# Altium project PCB_Project.PrjPcb
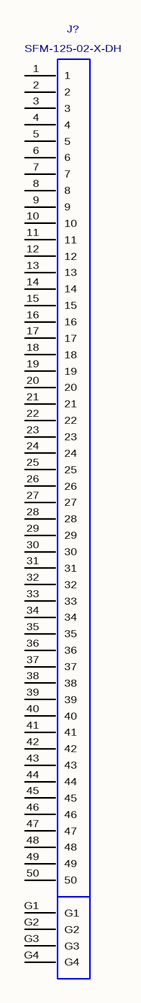
[diagram p0: DAQ Connector.SchDoc]
4 sheets, 80 parts. Net scope: flat (ports and power ports of the same name join across sheets).
Board file: FC_MainBoard.PcbDoc
Sheets:
  DAQ Connector.SchDoc
  Charge Amp.SchDoc
  Analog to Digital Con.SchDoc
  Low Pass Filter.SchDoc

## Sheet DAQ Connector.SchDoc
size A

### Parts
J?  SFM-125-02-X-DH  [SFM-125-02-X-DH]

### Nets

Not connected (* = marked no-connect by the designer): J? 1 2 3 4 5 6 7 8 9 10 11 12 13 14 15 16 17 18 19 20 21 22 23 24 25 26 27 28 29 30 31 32 33 34 35 36 37 38 39 40 41 42 43 44 45 46 47 48 49 50 G1 G2 G3 G4

### Library data of the parts
J? = SFM-125-02-X-DH: .050" (1,27mm) Tiger Eye Contact, Molded-to-Position Socket Strip, Double Horizontal.; MANUFACTURER: SAMTEC; CREATED: October 28, 2015 - Wendy Xin; PCB DECAL: SFM-125-02-X-DH

## Sheet Charge Amp.SchDoc
size A
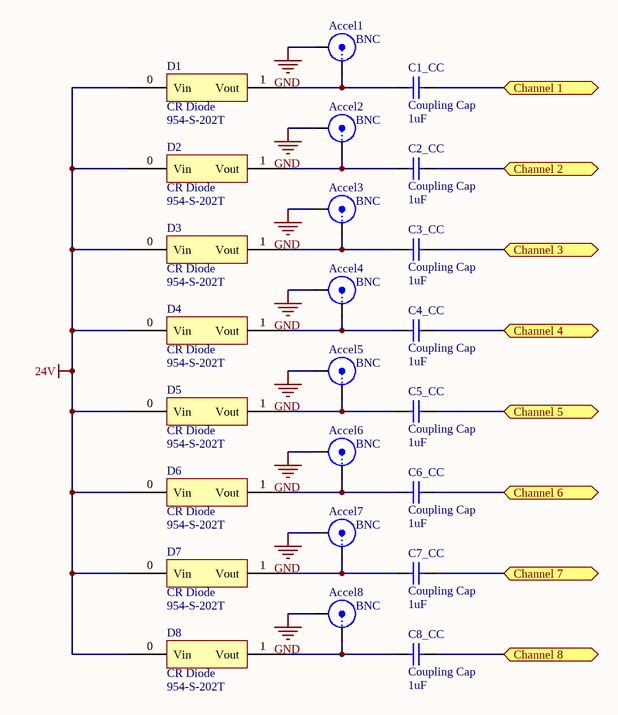
[diagram p1: Charge Amp.SchDoc]

### Parts
Accel1  BNC  [BNC_RA CON]
Accel2  BNC  [BNC_RA CON]
Accel3  BNC  [BNC_RA CON]
Accel4  BNC  [BNC_RA CON]
Accel5  BNC  [BNC_RA CON]
Accel6  BNC  [BNC_RA CON]
Accel7  BNC  [BNC_RA CON]
Accel8  BNC  [BNC_RA CON]
C1_CC  Coupling Cap  value 1uF  [C1206]
C2_CC  Coupling Cap  value 1uF  [C1206]
C3_CC  Coupling Cap  value 1uF  [C1206]
C4_CC  Coupling Cap  value 1uF  [C1206]
C5_CC  Coupling Cap  value 1uF  [C1206]
C6_CC  Coupling Cap  value 1uF  [C1206]
C7_CC  Coupling Cap  value 1uF  [C1206]
C8_CC  Coupling Cap  value 1uF  [C1206]
D1  CR Diode  Supplier Part Number 1: 954-S-202T  [CR Diode - duplicate1]
D2  CR Diode  Supplier Part Number 1: 954-S-202T  [CR Diode - duplicate1]
D3  CR Diode  Supplier Part Number 1: 954-S-202T  [CR Diode - duplicate1]
D4  CR Diode  Supplier Part Number 1: 954-S-202T  [CR Diode - duplicate1]
D5  CR Diode  Supplier Part Number 1: 954-S-202T  [CR Diode - duplicate1]
D6  CR Diode  Supplier Part Number 1: 954-S-202T  [CR Diode - duplicate1]
D7  CR Diode  Supplier Part Number 1: 954-S-202T  [CR Diode - duplicate1]
D8  CR Diode  Supplier Part Number 1: 954-S-202T  [CR Diode - duplicate1]

### Ports
Channel 1, Channel 2, Channel 3, Channel 4, Channel 5, Channel 6, Channel 7, Channel 8

### Nets
24V: D1.0(Vin) D2.0(Vin) D3.0(Vin) D4.0(Vin) D5.0(Vin) D6.0(Vin) D7.0(Vin) D8.0(Vin)
GND: Accel1.2(Y) Accel2.2(Y) Accel3.2(Y) Accel4.2(Y) Accel5.2(Y) Accel6.2(Y) Accel7.2(Y) Accel8.2(Y)
NetAccel1_1: Accel1.1(X) C1_CC.1 D1.1(Vout)
NetAccel2_1: Accel2.1(X) C2_CC.1 D2.1(Vout)
NetAccel3_1: Accel3.1(X) C3_CC.1 D3.1(Vout)
NetAccel4_1: Accel4.1(X) C4_CC.1 D4.1(Vout)
NetAccel5_1: Accel5.1(X) C5_CC.1 D5.1(Vout)
NetAccel6_1: Accel6.1(X) C6_CC.1 D6.1(Vout)
NetAccel7_1: Accel7.1(X) C7_CC.1 D7.1(Vout)
NetAccel8_1: Accel8.1(X) C8_CC.1 D8.1(Vout)
NetC1_CC_2: C1_CC.2 ; port Channel 1
NetC2_CC_2: C2_CC.2 ; port Channel 2
NetC3_CC_2: C3_CC.2 ; port Channel 3
NetC4_CC_2: C4_CC.2 ; port Channel 4
NetC5_CC_2: C5_CC.2 ; port Channel 5
NetC6_CC_2: C6_CC.2 ; port Channel 6
NetC7_CC_2: C7_CC.2 ; port Channel 7
NetC8_CC_2: C8_CC.2 ; port Channel 8

### Library data of the parts
Accel1-Accel8 = BNC: BNC Elbow Connector; LatestRevisionDate: 17-Jul-2002; LatestRevisionNote: Re-released for DXP Platform.; Publisher: Altium Limited
C1_CC C2_CC C3_CC C4_CC C5_CC C6_CC C7_CC C8_CC = Cap Semi: Capacitor (Semiconductor SIM Model); Published: 8-Jun-2000; LatestRevisionDate: 29-May-2009; LatestRevisionNote: IPC-7351 Footprint Added.; PackageReference: C1206; Publisher: Altium Limited; PackageDescription: Chip Capacitor
D1-D8 = Diode_1: Current Regulator Diodes 100V 2mA; Supplier 1: Mouser

## Sheet Analog to Digital Con.SchDoc
size A
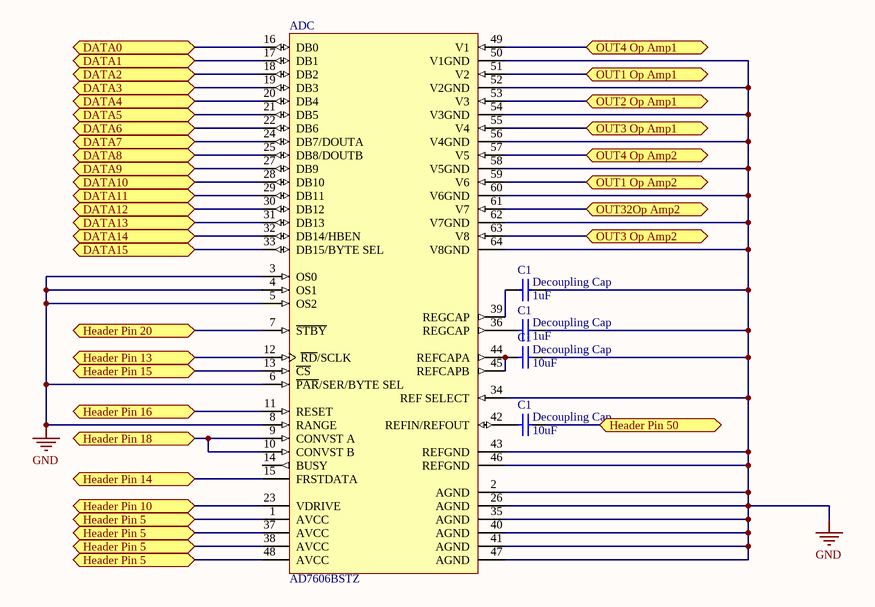
[diagram p2: Analog to Digital Con.SchDoc]

### Parts
(Parts that share a designator on the sheet are numbered #1, #2 ... from top to bottom, then left to right.)
ADC  AD7606BSTZ  [ST-64-2_N]
C1#1  Decoupling Cap  value 1uF  [C1206]
C1#2  Decoupling Cap  value 1uF  [C1206]
C1#3  Decoupling Cap  value 10uF  [C1206]
C1#4  Decoupling Cap  value 10uF  [C1206]

### Ports
DATA0, DATA1, DATA2, DATA3, DATA4, DATA5, DATA6, DATA7, DATA8, DATA9, DATA10, DATA11, DATA12, DATA13, DATA14, DATA15, Header Pin 5, Header Pin 10, Header Pin 13, Header Pin 14, Header Pin 15, Header Pin 16, Header Pin 18, Header Pin 20, Header Pin 50, OUT1 Op Amp1, OUT1 Op Amp2, OUT2 Op Amp1, OUT3 Op Amp1, OUT3 Op Amp2, OUT4 Op Amp1, OUT4 Op Amp2, OUT32Op Amp2

### Nets
GND: ADC.2(AGND) ADC.3(OS0) ADC.4(OS1) ADC.5(OS2) ADC.6(~{PAR}/SER/BYTE_SEL) ADC.8(RANGE) ADC.26(AGND) ADC.34(REF_SELECT) ADC.35(AGND) ADC.40(AGND) ADC.41(AGND) ADC.43(REFGND) ADC.46(REFGND) ADC.47(AGND) ADC.50(V1GND) ADC.52(V2GND) ADC.54(V3GND) ADC.56(V4GND) ADC.58(V5GND) ADC.60(V6GND) ADC.62(V7GND) ADC.64(V8GND) C1#1.1 C1#2.1 C1#3.1
NetADC_1: ADC.1(AVCC) ADC.37(AVCC) ADC.38(AVCC) ADC.48(AVCC) ; port Header Pin 5
NetADC_7: ADC.7(~{STBY}) ; port Header Pin 20
NetADC_9: ADC.9(CONVST_A) ADC.10(CONVST_B) ; port Header Pin 18
NetADC_11: ADC.11(RESET) ; port Header Pin 16
NetADC_12: ADC.12(~{RD}/SCLK) ; port Header Pin 13
NetADC_13: ADC.13(~{CS}) ; port Header Pin 15
NetADC_15: ADC.15(FRSTDATA) ; port Header Pin 14
NetADC_16: ADC.16(DB0) ; port DATA0
NetADC_17: ADC.17(DB1) ; port DATA1
NetADC_18: ADC.18(DB2) ; port DATA2
NetADC_19: ADC.19(DB3) ; port DATA3
NetADC_20: ADC.20(DB4) ; port DATA4
NetADC_21: ADC.21(DB5) ; port DATA5
NetADC_22: ADC.22(DB6) ; port DATA6
NetADC_23: ADC.23(VDRIVE) ; port Header Pin 10
NetADC_24: ADC.24(DB7/DOUTA) ; port DATA7
NetADC_25: ADC.25(DB8/DOUTB) ; port DATA8
NetADC_27: ADC.27(DB9) ; port DATA9
NetADC_28: ADC.28(DB10) ; port DATA10
NetADC_29: ADC.29(DB11) ; port DATA11
NetADC_30: ADC.30(DB12) ; port DATA12
NetADC_31: ADC.31(DB13) ; port DATA13
NetADC_32: ADC.32(DB14/HBEN) ; port DATA14
NetADC_33: ADC.33(DB15/BYTE_SEL) ; port DATA15
NetADC_36: ADC.36(REGCAP) C1#2.2
NetADC_39: ADC.39(REGCAP) C1#1.2
NetADC_42: ADC.42(REFIN/REFOUT) C1#4.2
NetADC_44: ADC.44(REFCAPA) ADC.45(REFCAPB) C1#3.2
NetADC_49: ADC.49(V1) ; port OUT4 Op Amp1
NetADC_51: ADC.51(V2) ; port OUT1 Op Amp1
NetADC_53: ADC.53(V3) ; port OUT2 Op Amp1
NetADC_55: ADC.55(V4) ; port OUT3 Op Amp1
NetADC_57: ADC.57(V5) ; port OUT4 Op Amp2
NetADC_59: ADC.59(V6) ; port OUT1 Op Amp2
NetADC_61: ADC.61(V7) ; port OUT32Op Amp2
NetADC_63: ADC.63(V8) ; port OUT3 Op Amp2
NetC1#4_1: C1#4.1 ; port Header Pin 50

Not connected (* = marked no-connect by the designer): ADC 14(BUSY)

### Library data of the parts
ADC = AD7606BSTZ: 8 Channel Data Acquisition System with 16-Bit, Bipolar Input, Simultaneous Sampling Analog-to-Digital Converter with Parallel, Serial and SPI Interface, 200KSPS, -40 to +85 degC, ST-64-2, Pb-Free, Tray; Generic Part Number: AD7606; Manufacturer: Analog Devices; Resolution (Bits): 16; Channels: 8; Throughput Rate (SPS): 200K; Interface: Par, Ser, SPI; DatasheetVersion: Rev.C; PackageVersion: 051706-A; PackageReference: ST-64-2; PackageDescription: 64-Lead Low Profile Quad Flat Package [LQFP]; Supplier 1: Digi-Key; Supplier Part Number 1: AD7606BSTZ-ND; Supplier 2: Farnell; Supplier Part Number 2: 1864685; Supplier 3: Newark; Supplier Part Number 3: 76R7614; Supplier 4: Mouser; Supplier Part Number 4: 584-AD7606BSTZ; RoHS: Y; Packing: Tray; Mounting Technology: Surface Mount; Code_JEDEC: MS-026-BCD; PartNumber: AD7606BSTZ; ComponentLink1Description: Manufacturer URL; ComponentLink1URL: http://www.analog.com/en/index.html; ComponentLink2Description: Datasheet; ComponentLink2URL: http://www.analog.com/static/imported-files/data_sheets/AD7606_7606-6_7606-4.pdf; ComponentLink3Description: Package Specification; ComponentLink3URL: http://www.analog.com/static/imported-files/packages/PKG_PDF/LQFP%28ST%29/ST_64_2.pdf; ComponentLink4Description: Product URL; ComponentLink4URL: http://www.analog.com/en/analog-to-digital-converters/ad-converters/ad7606/products/product.html
C1#1-C1#4 = Cap Semi: Capacitor (Semiconductor SIM Model); Published: 8-Jun-2000; LatestRevisionDate: 29-May-2009; LatestRevisionNote: IPC-7351 Footprint Added.; PackageReference: C1206; Publisher: Altium Limited; PackageDescription: Chip Capacitor

## Sheet Low Pass Filter.SchDoc
size A
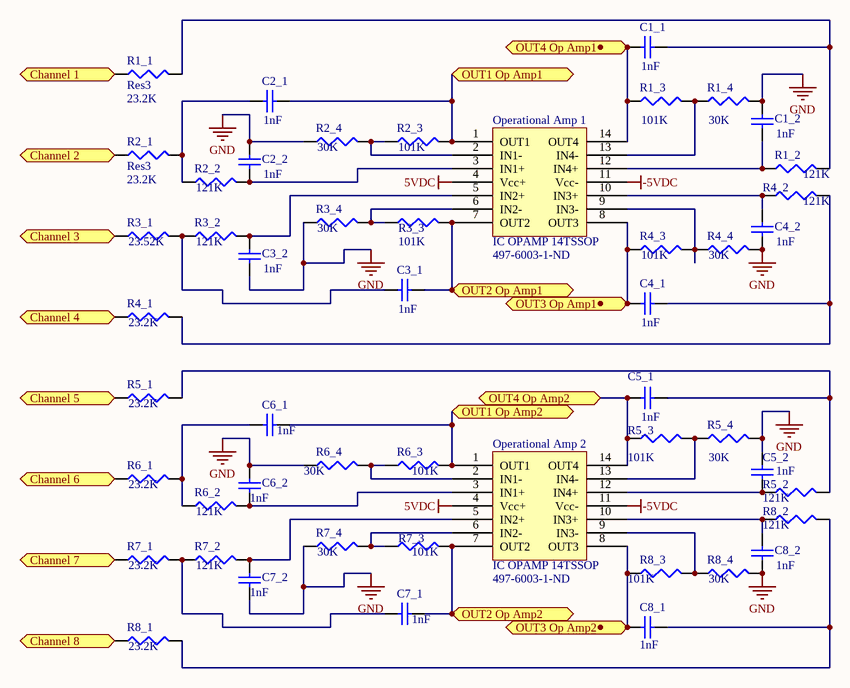
[diagram p3: Low Pass Filter.SchDoc]

### Parts
C1_1  value 1nF  [C1206]  (hidden comment: Cap Semi)
C1_2  value 1nF  [C1206]  (hidden comment: Cap Semi)
C2_1  value 1nF  [C1206]  (hidden comment: Cap Semi)
C2_2  value 1nF  [C1206]  (hidden comment: Cap Semi)
C3_1  value 1nF  [C1206]  (hidden comment: Cap Semi)
C3_2  value 1nF  [C1206]  (hidden comment: Cap Semi)
C4_1  value 1nF  [C1206]  (hidden comment: Cap Semi)
C4_2  value 1nF  [C1206]  (hidden comment: Cap Semi)
C5_1  value 1nF  [C1206]  (hidden comment: Cap Semi)
C5_2  value 1nF  [C1206]  (hidden comment: Cap Semi)
C6_1  value 1nF  [C1206]  (hidden comment: Cap Semi)
C6_2  value 1nF  [C1206]  (hidden comment: Cap Semi)
C7_1  value 1nF  [C1206]  (hidden comment: Cap Semi)
C7_2  value 1nF  [C1206]  (hidden comment: Cap Semi)
C8_1  value 1nF  [C1206]  (hidden comment: Cap Semi)
C8_2  value 1nF  [C1206]  (hidden comment: Cap Semi)
Operational_Amp_1  IC OPAMP 14TSSOP  Supplier Part Number 1: 497-6003-1-ND  [TSV994IPT]
Operational_Amp_2  IC OPAMP 14TSSOP  Supplier Part Number 1: 497-6003-1-ND  [TSV994IPT]
R1_1  Res3  value 23.2K  [J1-0603]
R1_2  value 121K  [J1-0603]  (hidden comment: Res3)
R1_3  value 101K  [J1-0603]  (hidden comment: Res3)
R1_4  value 30K  [J1-0603]  (hidden comment: Res3)
R2_1  Res3  value 23.2K  [J1-0603]
R2_2  value 121K  [J1-0603]  (hidden comment: Res3)
R2_3  value 101K  [J1-0603]  (hidden comment: Res3)
R2_4  value 30K  [J1-0603]  (hidden comment: Res3)
R3_1  value 23.52K  [J1-0603]  (hidden comment: Res3)
R3_2  value 121K  [J1-0603]  (hidden comment: Res3)
R3_3  value 101K  [J1-0603]  (hidden comment: Res3)
R3_4  value 30K  [J1-0603]  (hidden comment: Res3)
R4_1  value 23.2K  [J1-0603]  (hidden comment: Res3)
R4_2  value 121K  [J1-0603]  (hidden comment: Res3)
R4_3  value 101K  [J1-0603]  (hidden comment: Res3)
R4_4  value 30K  [J1-0603]  (hidden comment: Res3)
R5_1  value 23.2K  [J1-0603]  (hidden comment: Res3)
R5_2  value 121K  [J1-0603]  (hidden comment: Res3)
R5_3  value 101K  [J1-0603]  (hidden comment: Res3)
R5_4  value 30K  [J1-0603]  (hidden comment: Res3)
R6_1  value 23.2K  [J1-0603]  (hidden comment: Res3)
R6_2  value 121K  [J1-0603]  (hidden comment: Res3)
R6_3  value 101K  [J1-0603]  (hidden comment: Res3)
R6_4  value 30K  [J1-0603]  (hidden comment: Res3)
R7_1  value 23.2K  [J1-0603]  (hidden comment: Res3)
R7_2  value 121K  [J1-0603]  (hidden comment: Res3)
R7_3  value 101K  [J1-0603]  (hidden comment: Res3)
R7_4  value 30K  [J1-0603]  (hidden comment: Res3)
R8_1  value 23.2K  [J1-0603]  (hidden comment: Res3)
R8_2  value 121K  [J1-0603]  (hidden comment: Res3)
R8_3  value 101K  [J1-0603]  (hidden comment: Res3)
R8_4  value 30K  [J1-0603]  (hidden comment: Res3)

### Ports
Channel 1, Channel 2, Channel 3, Channel 4, Channel 5, Channel 6, Channel 7, Channel 8, OUT1 Op Amp1, OUT1 Op Amp2, OUT2 Op Amp1, OUT2 Op Amp2, OUT3 Op Amp1, OUT3 Op Amp2, OUT4 Op Amp1, OUT4 Op Amp2

### Nets
5VDC: Operational_Amp_1.4(Vcc+) Operational_Amp_2.4(Vcc+)
-5VDC: Operational_Amp_1.11(Vcc-) Operational_Amp_2.11(Vcc-)
GND: C1_2.1 C2_2.2 C3_2.1 C4_2.1 C5_2.2 C6_2.2 C7_2.1 C8_2.1 R1_4.2 R2_4.1 R3_4.1 R4_4.2 R5_4.2 R6_4.1 R7_4.1 R8_4.2
NetADC_49: C1_1.1 Operational_Amp_1.14(OUT4) R1_3.1 ; port OUT4 Op Amp1
NetADC_51: C2_1.2 Operational_Amp_1.1(OUT1) R2_3.2 ; port OUT1 Op Amp1
NetADC_53: C3_1.2 Operational_Amp_1.7(OUT2) R3_3.2 ; port OUT2 Op Amp1
NetADC_55: C4_1.1 Operational_Amp_1.8(OUT3) R4_3.1 ; port OUT3 Op Amp1
NetADC_57: C5_1.1 Operational_Amp_2.14(OUT4) R5_3.1 ; port OUT4 Op Amp2
NetADC_59: C6_1.2 Operational_Amp_2.1(OUT1) R6_3.2 ; port OUT1 Op Amp2
NetADC_63: C8_1.2 Operational_Amp_2.8(OUT3) R8_3.1 ; port OUT3 Op Amp2
NetC1_1_2: C1_1.2 R1_1.2 R1_2.2
NetC1_2_2: C1_2.2 Operational_Amp_1.12(IN4+) R1_2.1
NetC1_CC_2: R1_1.1 ; port Channel 1
NetC2_1_1: C2_1.1 R2_1.2 R2_2.1
NetC2_2_1: C2_2.1 Operational_Amp_1.3(IN1+) R2_2.2
NetC2_CC_2: R2_1.1 ; port Channel 2
NetC3_1_1: C3_1.1 R3_1.2 R3_2.1
NetC3_2_2: C3_2.2 Operational_Amp_1.5(IN2+) R3_2.2
NetC3_CC_2: R3_1.1 ; port Channel 3
NetC4_1_2: C4_1.2 R4_1.2 R4_2.2
NetC4_2_2: C4_2.2 Operational_Amp_1.10(IN3+) R4_2.1
NetC4_CC_2: R4_1.1 ; port Channel 4
NetC5_1_2: C5_1.2 R5_1.2 R5_2.2
NetC5_2_1: C5_2.1 Operational_Amp_2.12(IN4+) R5_2.1
NetC5_CC_2: R5_1.1 ; port Channel 5
NetC6_1_1: C6_1.1 R6_1.2 R6_2.1
NetC6_2_1: C6_2.1 Operational_Amp_2.3(IN1+) R6_2.2
NetC6_CC_2: R6_1.1 ; port Channel 6
NetC7_1_1: C7_1.1 R7_1.2 R7_2.1
NetC7_1_2: C7_1.2 Operational_Amp_2.7(OUT2) R7_3.2 ; port OUT2 Op Amp2
NetC7_2_2: C7_2.2 Operational_Amp_2.5(IN2+) R7_2.2
NetC7_CC_2: R7_1.1 ; port Channel 7
NetC8_1_1: C8_1.1 R8_1.2 R8_2.2
NetC8_2_2: C8_2.2 Operational_Amp_2.10(IN3+) R8_2.1
NetC8_CC_2: R8_1.1 ; port Channel 8
NetOperational_Amp_1_2: Operational_Amp_1.2(IN1-) R2_3.1 R2_4.2
NetOperational_Amp_1_6: Operational_Amp_1.6(IN2-) R3_3.1 R3_4.2
NetOperational_Amp_1_9: Operational_Amp_1.9(IN3-) R4_3.2 R4_4.1
NetOperational_Amp_1_13: Operational_Amp_1.13(IN4-) R1_3.2 R1_4.1
NetOperational_Amp_2_2: Operational_Amp_2.2(IN1-) R6_3.1 R6_4.2
NetOperational_Amp_2_6: Operational_Amp_2.6(IN2-) R7_3.1 R7_4.2
NetOperational_Amp_2_9: Operational_Amp_2.9(IN3-) R8_3.2 R8_4.1
NetOperational_Amp_2_13: Operational_Amp_2.13(IN4-) R5_3.2 R5_4.1

### Library data of the parts
C1_1 C1_2 C2_1 C2_2 C3_1 C3_2 C4_1 C4_2 C5_1 C5_2 C6_1 C6_2 C7_1 C7_2 C8_1 C8_2 = Cap Semi: Capacitor (Semiconductor SIM Model); Published: 8-Jun-2000; LatestRevisionDate: 29-May-2009; LatestRevisionNote: IPC-7351 Footprint Added.; PackageReference: C1206; Publisher: Altium Limited; PackageDescription: Chip Capacitor
Operational_Amp_1 Operational_Amp_2 = Component_1: Supplier 1: Digi-Key
R1_1-R1_4 R2_1-R2_4 R3_1-R3_4 R4_1-R4_4 R5_1-R5_4 R6_1-R6_4 R7_1-R7_4 R8_1-R8_4 = Res3: Resistor; Published: 8-Jun-2000; LatestRevisionDate: 29-May-2009; LatestRevisionNote: IPC-7351 Footprint Added.; PackageReference: J1-0603; Publisher: Altium Limited; PackageDescription: Chip Resistor

## Nets that join several sheets
GND: Charge Amp (8 pins), Analog to Digital Con (25 pins), Low Pass Filter (16 pins)
NetADC_49: Analog to Digital Con (ADC.49), Low Pass Filter (C1_1.1 Operational_Amp_1.14 R1_3.1)
NetADC_51: Analog to Digital Con (ADC.51), Low Pass Filter (C2_1.2 Operational_Amp_1.1 R2_3.2)
NetADC_53: Analog to Digital Con (ADC.53), Low Pass Filter (C3_1.2 Operational_Amp_1.7 R3_3.2)
NetADC_55: Analog to Digital Con (ADC.55), Low Pass Filter (C4_1.1 Operational_Amp_1.8 R4_3.1)
NetADC_57: Analog to Digital Con (ADC.57), Low Pass Filter (C5_1.1 Operational_Amp_2.14 R5_3.1)
NetADC_59: Analog to Digital Con (ADC.59), Low Pass Filter (C6_1.2 Operational_Amp_2.1 R6_3.2)
NetADC_63: Analog to Digital Con (ADC.63), Low Pass Filter (C8_1.2 Operational_Amp_2.8 R8_3.1)
NetC1_CC_2: Charge Amp (C1_CC.2), Low Pass Filter (R1_1.1)
NetC2_CC_2: Charge Amp (C2_CC.2), Low Pass Filter (R2_1.1)
NetC3_CC_2: Charge Amp (C3_CC.2), Low Pass Filter (R3_1.1)
NetC4_CC_2: Charge Amp (C4_CC.2), Low Pass Filter (R4_1.1)
NetC5_CC_2: Charge Amp (C5_CC.2), Low Pass Filter (R5_1.1)
NetC6_CC_2: Charge Amp (C6_CC.2), Low Pass Filter (R6_1.1)
NetC7_CC_2: Charge Amp (C7_CC.2), Low Pass Filter (R7_1.1)
NetC8_CC_2: Charge Amp (C8_CC.2), Low Pass Filter (R8_1.1)